# Altium schematic sheet Schematic_Top.SchDoc
size A4; SheetNumber: 4; SheetTotal: 8
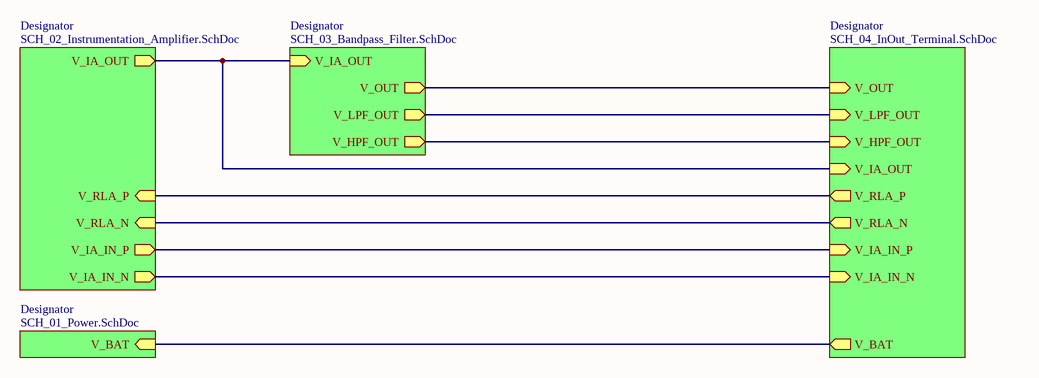
[diagram p0: Schematic_Top.SchDoc]

## Sub-sheets
Designator = SCH_02_Instrumentation_Amplifier.SchDoc: V_IA_OUT (out), V_IA_IN_P (out), V_IA_IN_N (out), V_RLA_P (in), V_RLA_N (in)
Designator = SCH_01_Power.SchDoc: V_BAT (in)
Designator = SCH_03_Bandpass_Filter.SchDoc: V_IA_OUT (in), V_OUT (out), V_LPF_OUT (out), V_HPF_OUT (out)
Designator = SCH_04_InOut_Terminal.SchDoc: V_OUT (in), V_LPF_OUT (in), V_HPF_OUT (in), V_IA_OUT (in), V_IA_IN_P (in), V_IA_IN_N (in), V_RLA_P (out), V_RLA_N (out), V_BAT (out)

## Nets
(unnamed): sheet Designator/V_IA_OUT, sheet Designator/V_IA_OUT, sheet Designator/V_IA_OUT
(unnamed): sheet Designator/V_IA_IN_P, sheet Designator/V_IA_IN_P
(unnamed): sheet Designator/V_IA_IN_N, sheet Designator/V_IA_IN_N
(unnamed): sheet Designator/V_RLA_P, sheet Designator/V_RLA_P
(unnamed): sheet Designator/V_RLA_N, sheet Designator/V_RLA_N
(unnamed): sheet Designator/V_BAT, sheet Designator/V_BAT
(unnamed): sheet Designator/V_OUT, sheet Designator/V_OUT
(unnamed): sheet Designator/V_LPF_OUT, sheet Designator/V_LPF_OUT
(unnamed): sheet Designator/V_HPF_OUT, sheet Designator/V_HPF_OUT

## Notes on the sheet
- Title:
- Date:
- Time:
- Drawn by:
- Phung Nhat Minh
- Sheet
- of